# EAGLE schematic focus_coil_drive (EAGLE 7.5.0)
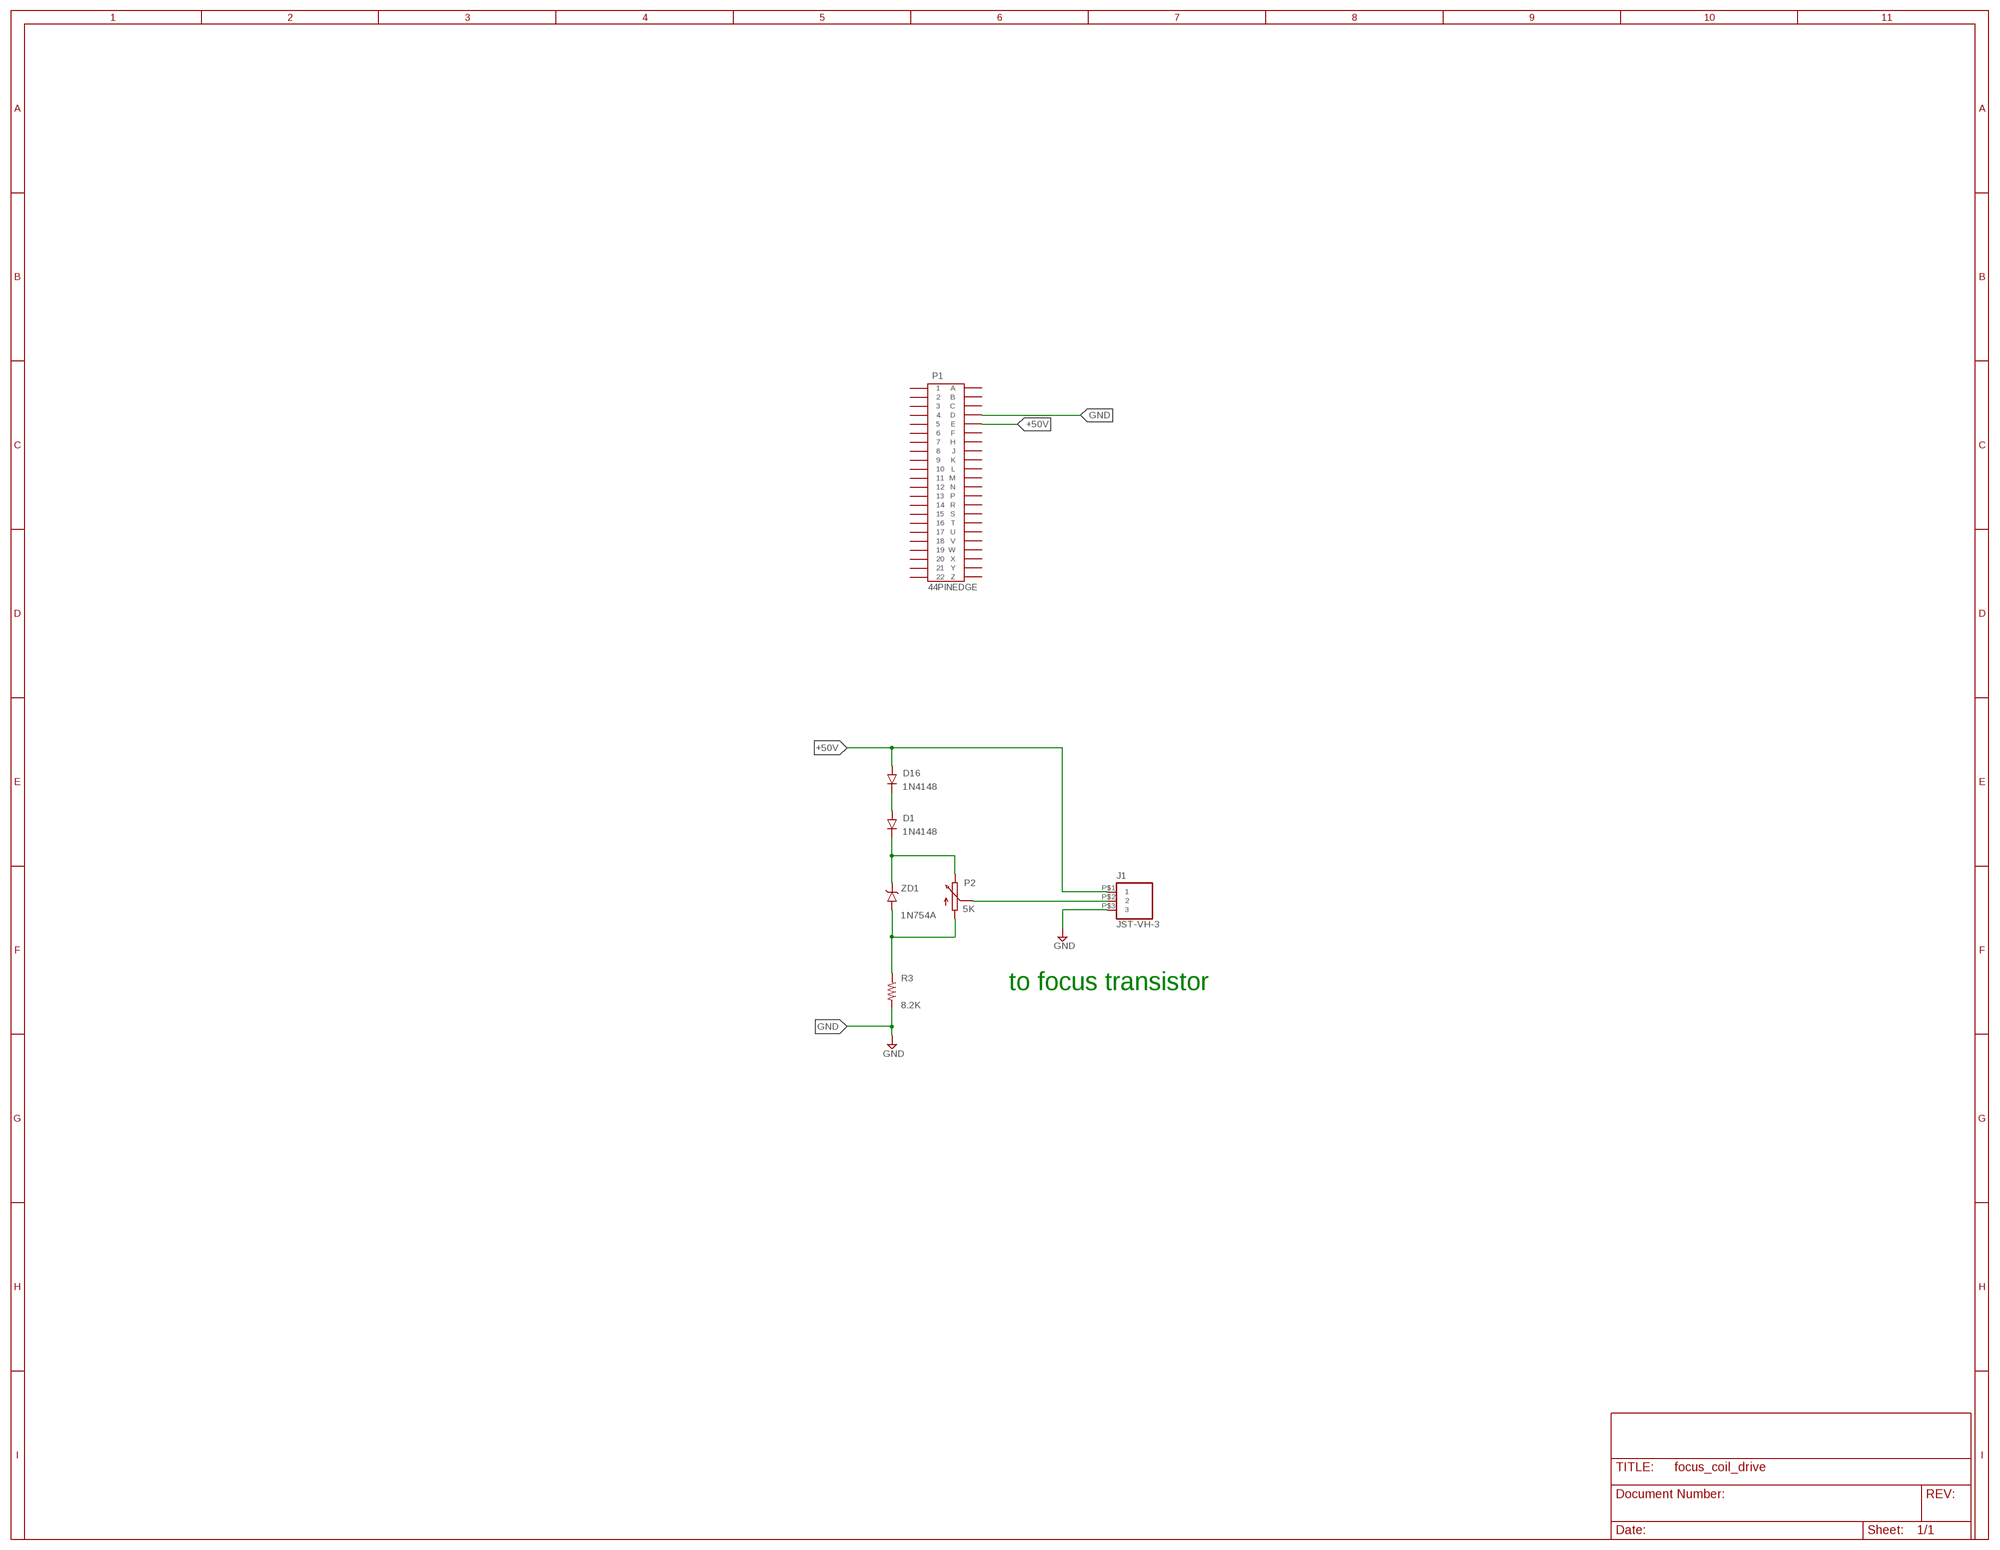
[diagram p0: schematic, sheet 1]

## Parts
D1  1N4148  [DO35-7]
D16  1N4148  [DO35-7]
J1  JST-VH-3  [VHR-3N]
P1  44PINEDGE  [44PINEDGE]
P2  5K  POT-3006P  [3006P]
R3  8.2K  RES-V  [0207/10]
ZD1  1N754A  [DO35-7]

## Nets
+50V: D16.A J1.P$1 P1.E
BASE: J1.P$2 P2.2(S)
GND: J1.P$3 P1.D R3.2
N$1: D1.A D16.C
N$3: D1.C P2.3(E) ZD1.C
N$6: P2.1(A) R3.1 ZD1.A
Unconnected: P1.1 P1.2 P1.3 P1.4 P1.5 P1.6 P1.7 P1.8 P1.9 P1.10 P1.11 P1.12 P1.13 P1.14 P1.15 P1.16 P1.17 P1.18 P1.19 P1.20 P1.21 P1.22 P1.A P1.B P1.C P1.F P1.H P1.J P1.K P1.L P1.M P1.N P1.P P1.R P1.S P1.T P1.U P1.V P1.W P1.X P1.Y P1.Z

## Notes on the sheet
- to focus transistor

## Library data of the parts
D1 D16 = keiths:1N4148: High Conductance Fast Diode
J1 = keiths:JST-VH-3: JST CONN HEADER VH SIDE 3POS 3.96MM
P1 = keiths:44PINEDGE: 44 PIN EDGE CONNECTOR FOR PCB
P2 = keiths:POT-3006P: 3006 - Trimpot® Trimming Potentiometer. Clockwise turn moves wiper to pin 3; PN: 3006W-1-200LF
R3 = keiths:RES-V: 1/4 watt through hole size
ZD1 = keiths:1N754A: Zener diode 500mW, 5% TOLERANCE